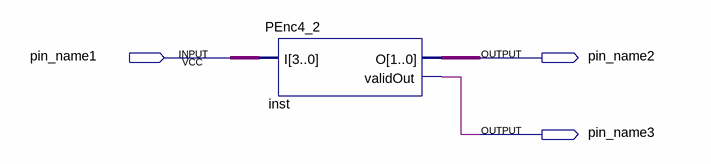
[diagram p0: schematic sheet]
// Quartus schematic PEnc4_2Demo.bdf as structural Verilog: 1 symbols, 3 pins
module PEnc4_2Demo (
  input  pin_name1,
  output pin_name2,
  output pin_name3
);

  wire [1:0] inst_o;
  wire [3:0] undriven;

  PEnc4_2 inst (.I(undriven), .O(inst_o), .validOut(pin_name3));
endmodule
